# EAGLE board axion (EAGLE 8.3.1)
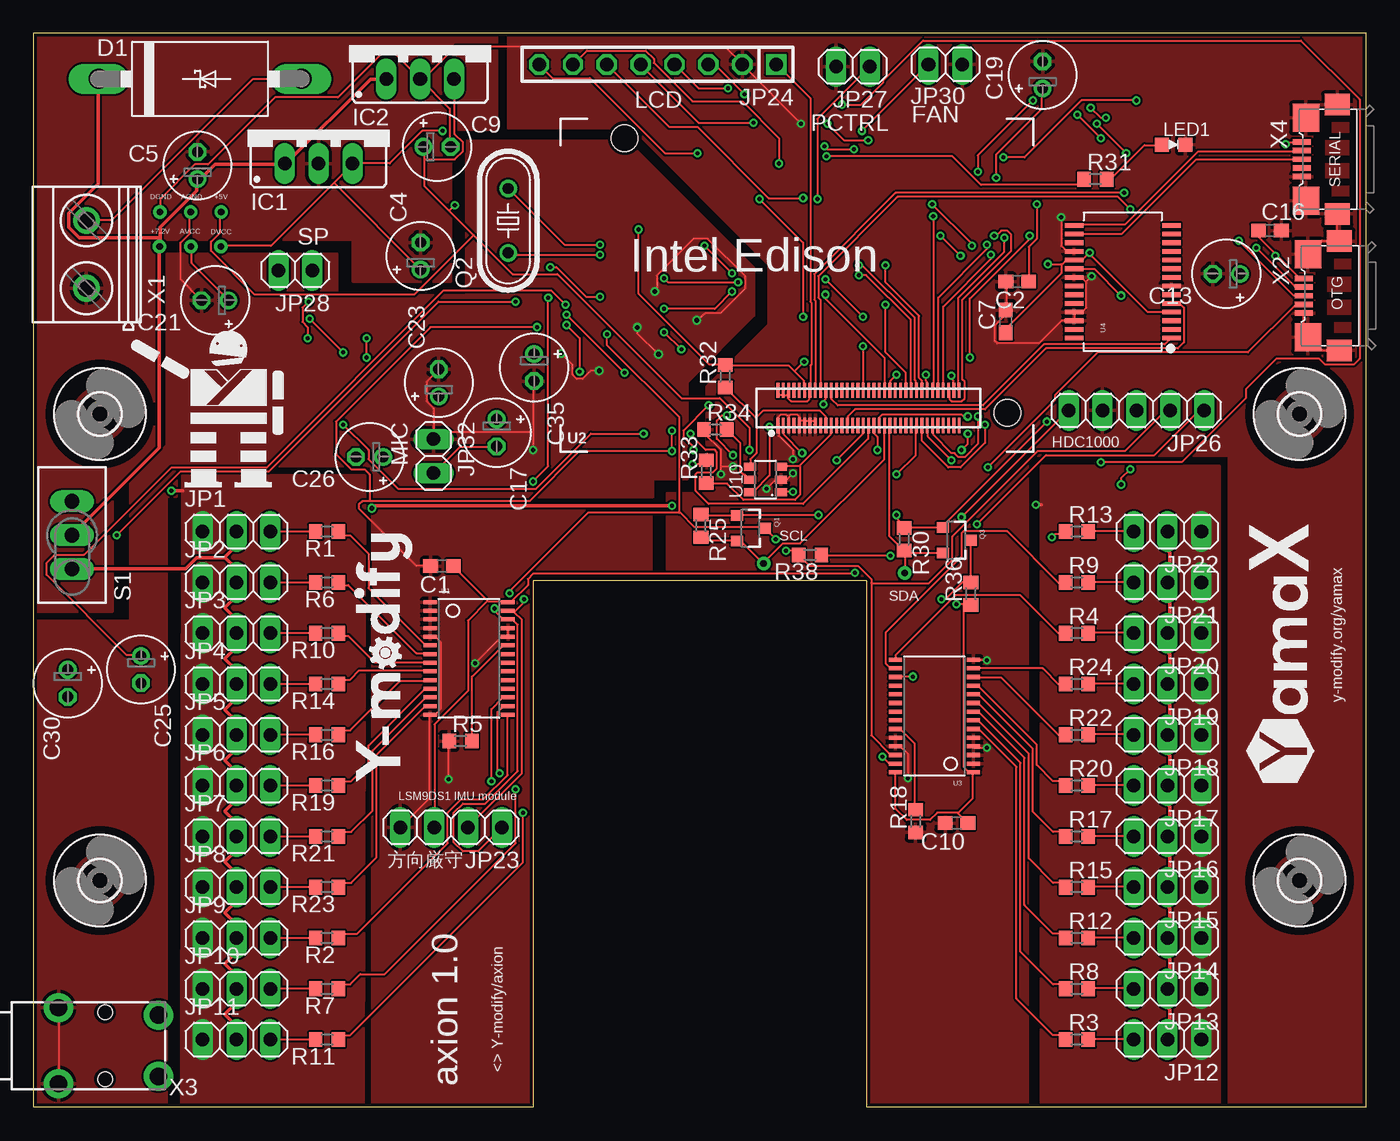
[diagram p1: board, top side]
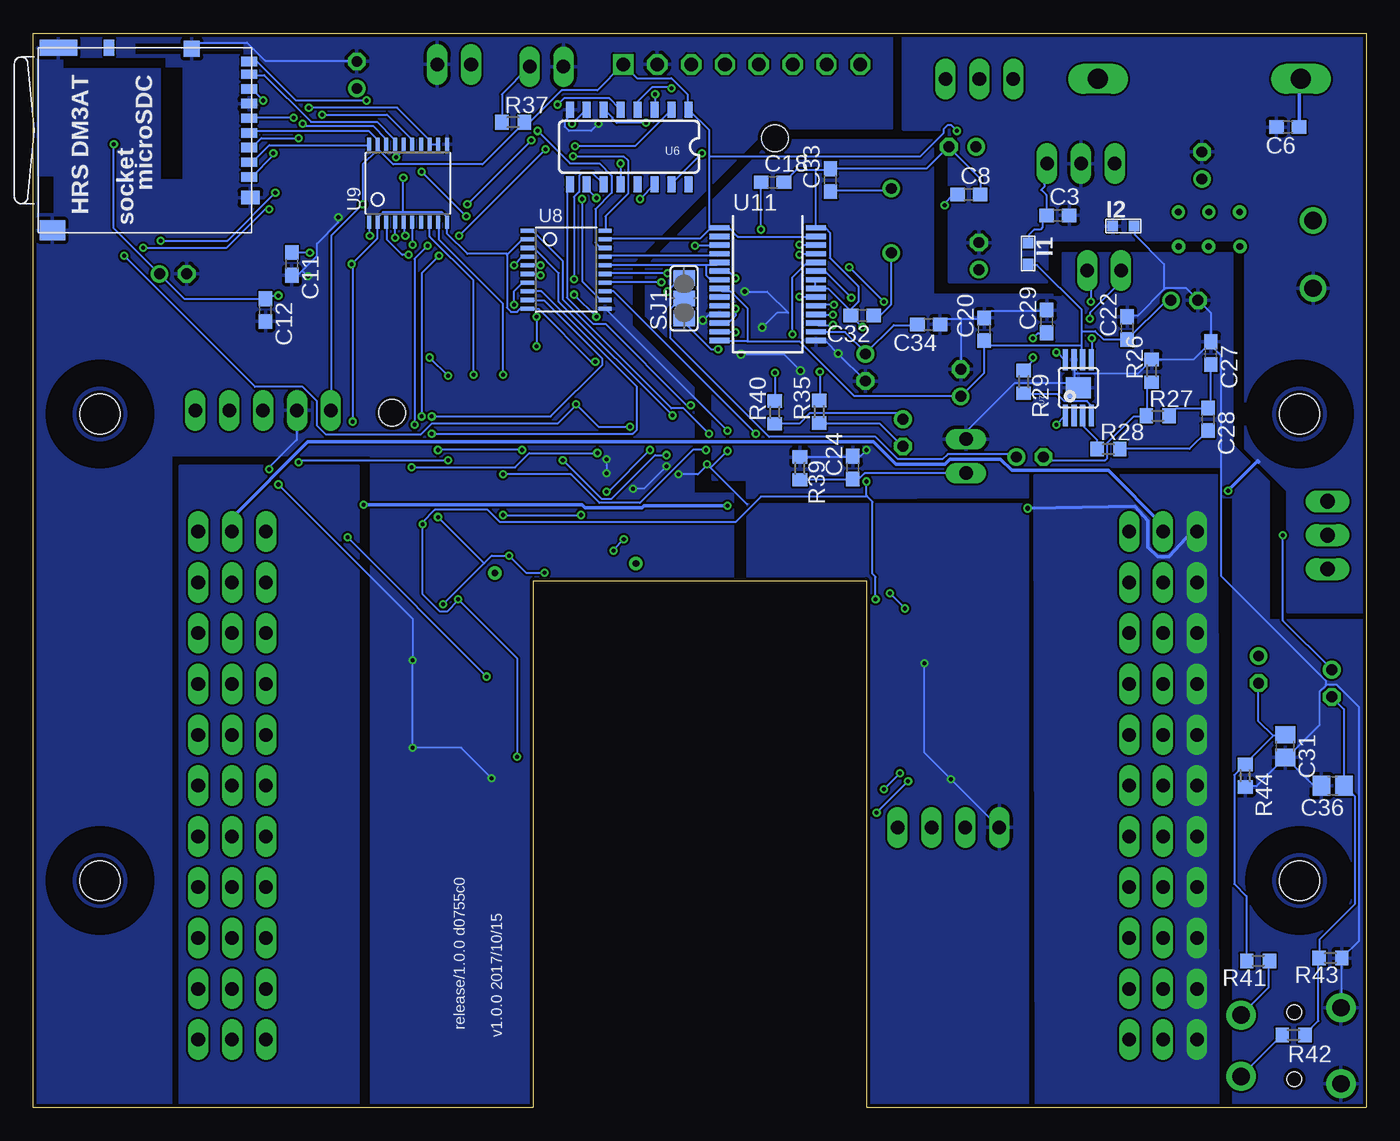
[diagram p2: board, bottom side, seen from below]

Size 100 x 80.55 mm. Coordinates in mm from the lower left corner, seen from the top.
Outline: 100,0 100,80.55 0,80.55 0,0 37.5,0 37.5,39.5 62.5,39.5 62.5,0 100,0
Copper layers (1*16): Top 0.035mm / dielectric 1.5mm / Bottom 0.035mm
Design rules "SeeedStudio_2layer_DRU_no_angle_20140221": minimum track width 6mil, minimum drill 12mil, track to track 6mil, track to pad 6mil, pad to pad 6mil, via to via 6mil, smd to smd 0mil, copper to edge 10mil, drill to drill 10mil, minimum pad ring 10mil, minimum via ring 6mil, stop-mask expansion 2mil, vias tented up to drill 100mil, thermal gap 10mil
Net classes: 1 motorpower: width 0.254 mm, drill 0.152 mm; 2 power: width 0.152 mm, drill 0.152 mm

## Footprints (pad centres in the part's own frame; a part is rotated, then mirrored left to right if it is on the bottom)
C1608 = smd 1.1 x 1: 1 -0.85,0; 2 0.85,0
E2-5 = drill 0.813 pad 1.27: + -1.016,0 | drill 0.813 pad 1.27 octagon: - 1.016,0
C0805 = smd 1.3 x 1.5: 1 -0.85,0; 2 0.85,0
DO201T15 = drill 1.499 long: A 7.62,0; C -7.62,0
3,0 = hole 3: 0,0
1608(1.6*0.8MM) = smd 0.8 x 0.8: P$3 -0.8,0; P$4 0.8,0
78XXS = drill 1.016 long: GND 0,-2.54; IN -2.54,-2.54; OUT 2.54,-2.54
1X03 = drill 1.016 long: 1 -2.54,0; 2 0,0; 3 2.54,0
1X04 = drill 1.016 long: 1 -3.81,0; 2 -1.27,0; 3 1.27,0; 4 3.81,0
1X08 = drill 1.016 square: 1 -8.89,0 | drill 1.016 octagon: 2 -6.35,0; 3 -3.81,0; 4 -1.27,0; 5 1.27,0; 6 3.81,0; 7 6.35,0; 8 8.89,0
DM3AT-SF-PEJ = smd 0.7 x 1.2: 1 0,0.6; 2 -1.1,0.6; 3 -2.2,0.6; 4 -3.3,0.6; 5 -4.4,0.6; 6 -5.5,0.6; 7 -6.6,0.6; 8 -7.7,0.6; CC1 -8.65,0.6 | smd 1.2 x 2.8: CASE1 -9.7,-13.7 | smd 1.5 x 1.9: CASE2 4,-14.15 | smd 1 x 1.4: CASE3 1.55,0.7 | smd 1.2 x 1.2: CASE4 -9.6,-3.7 | smd 1.2 x 0.8: CC2 -9.7,-9.9
1X05 = drill 1.016 long: 1 -5.08,0; 2 -2.54,0; 3 0,0; 4 2.54,0; 5 5.08,0
1X02 = drill 1.016 long: 1 -1.27,0; 2 1.27,0
LED1608 = smd 1.05 x 1.08: A -0.875,0; K 0.875,0
SOT23-3 = smd 0.8 x 0.9: 1 -0.95,-1; 2 0.95,-1; 3 0,1.1
HC49/S = drill 0.813: 1 -2.413,0; 2 2.413,0
R0603 = smd 1 x 1.1: 1 -0.85,0; 2 0.85,0
TL3XPO = drill 1.1 pad 1.422 long: 1 -2.54,0; 2 0,0; 3 2.54,0
SJ_2 = smd 1.168 x 1.6: 1 -1.524,0; 2 0,0; 3 1.524,0
ROUND-AUTO-0.5 = drill 0.5: TP 0,0
TSSOP28 = smd 0.305 x 0.991: 1 -4.225,-2.918; 2 -3.575,-2.918; 3 -2.925,-2.918; 4 -2.275,-2.918; 5 -1.625,-2.918; 6 -0.975,-2.918; 7 -0.325,-2.918; 8 0.325,-2.918; 9 0.975,-2.918; 10 1.625,-2.918; 11 2.275,-2.918; 12 2.925,-2.918; 13 3.575,-2.918; 14 4.225,-2.918; 15 4.225,2.918; 16 3.575,2.918; 17 2.925,2.918; 18 2.275,2.918; 19 1.625,2.918; 20 0.975,2.918; 21 0.325,2.918; 22 -0.325,2.918; 23 -0.975,2.918; 24 -1.625,2.918; 25 -2.275,2.918; 26 -2.925,2.918; 27 -3.575,2.918; 28 -4.225,2.918
EDISON_DAUGHTER = smd 1.14 x 0.2: 1 1.98,19.17; 2 4.62,19.17; 3 1.98,18.77; 4 4.62,18.77; 5 1.98,18.37; 6 4.62,18.37; 7 1.98,17.97; 8 4.62,17.97; 9 1.98,17.57; 10 4.62,17.57; 11 1.98,17.17; 12 4.62,17.17; 13 1.98,16.77; 14 4.62,16.77; 15 1.98,16.37; 16 4.62,16.37; 17 1.98,15.97; 18 4.62,15.97; 19 1.98,15.57; 20 4.62,15.57; 21 1.98,15.17; 22 4.62,15.17; 23 1.98,14.77; 24 4.62,14.77; 25 1.98,14.37; 26 4.62,14.37; 27 1.98,13.97; 28 4.62,13.97; 29 1.98,13.57; 30 4.62,13.57; 31 1.98,13.17; 32 4.62,13.17; 33 1.98,12.77; 34 4.62,12.77; 35 1.98,12.37; 36 4.62,12.37; 37 1.98,11.97; 38 4.62,11.97; 39 1.98,11.57; 40 4.62,11.57; 41 1.98,11.17; 42 4.62,11.17; 43 1.98,10.77; 44 4.62,10.77; 45 1.98,10.37; 46 4.62,10.37; 47 1.98,9.97; 48 4.62,9.97; 49 1.98,9.57; 50 4.62,9.57; 51 1.98,9.17; 52 4.62,9.17; 53 1.98,8.77; 54 4.62,8.77; 55 1.98,8.37; 56 4.62,8.37; 57 1.98,7.97; 58 4.62,7.97; 59 1.98,7.57; 60 4.62,7.57; 61 1.98,7.17; 62 4.62,7.17; 63 1.98,6.77; 64 4.62,6.77; 65 1.98,6.37; 66 4.62,6.37; 67 1.98,5.97; 68 4.62,5.97; 69 1.98,5.57; 70 4.62,5.57 | hole 2: 23.53,30.67; 2.93,1.98
SSOP28DB = smd 0.348 x 1.397: 1 -4.225,-3.656; 2 -3.575,-3.656; 3 -2.925,-3.656; 4 -2.275,-3.656; 5 -1.625,-3.656; 6 -0.975,-3.656; 7 -0.325,-3.656; 8 0.325,-3.656; 9 0.975,-3.656; 10 1.625,-3.656; 11 2.275,-3.656; 12 2.925,-3.656; 13 3.575,-3.656; 14 4.225,-3.656; 15 4.225,3.656; 16 3.575,3.656; 17 2.925,3.656; 18 2.275,3.656; 19 1.625,3.656; 20 0.975,3.656; 21 0.325,3.656; 22 -0.325,3.656; 23 -0.975,3.656; 24 -1.625,3.656; 25 -2.275,3.656; 26 -2.925,3.656; 27 -3.575,3.656; 28 -4.225,3.656
SO016 = smd 0.6 x 1.2: 1 -4.445,-2.8; 2 -3.175,-2.8; 3 -1.905,-2.8; 4 -0.635,-2.8; 5 0.635,-2.8; 6 1.905,-2.8; 7 3.175,-2.8; 8 4.445,-2.8; 9 4.445,2.8; 10 3.175,2.8; 11 1.905,2.8; 12 0.635,2.8; 13 -0.635,2.8; 14 -1.905,2.8; 15 -3.175,2.8; 16 -4.445,2.8
POWER-SOP8 = smd 0.4 x 1.6: 1 -0.975,-2.1; 2 -0.325,-2.1; 3 0.325,-2.1; 4 0.975,-2.1; 5 0.975,2.1; 6 0.325,2.1; 7 -0.325,2.1; 8 -0.975,2.1 | smd 1.89 x 1.57: 9 0,0
TSSOP20 = smd 0.305 x 0.991: 1 -2.925,-2.918; 2 -2.275,-2.918; 3 -1.625,-2.918; 4 -0.975,-2.918; 5 -0.325,-2.918; 6 0.325,-2.918; 7 0.975,-2.918; 8 1.625,-2.918; 9 2.275,-2.918; 10 2.925,-2.918; 11 2.925,2.918; 12 2.275,2.918; 13 1.625,2.918; 14 0.975,2.918; 15 0.325,2.918; 16 -0.325,2.918; 17 -0.975,2.918; 18 -1.625,2.918; 19 -2.275,2.918; 20 -2.925,2.918
SOT23-6 = smd 0.6 x 0.9: 1 -0.95,-1.15; 2 0,-1.15; 3 0.95,-1.15; 4 0.95,1.15; 5 0,1.15; 6 -0.95,1.15
SSOP28 = smd 0.4 x 1.5: 1 -4.225,-3.625; 2 -3.575,-3.625; 3 -2.925,-3.625; 4 -2.275,-3.625; 5 -1.625,-3.625; 6 -0.975,-3.625; 7 -0.325,-3.625; 8 0.325,-3.625; 9 0.975,-3.625; 10 1.625,-3.625; 11 2.275,-3.625; 12 2.925,-3.625; 13 3.575,-3.625; 14 4.225,-3.625; 15 4.225,3.625; 16 3.575,3.625; 17 2.925,3.625; 18 2.275,3.625; 19 1.625,3.625; 20 0.975,3.625; 21 0.325,3.625; 22 -0.325,3.625; 23 -0.975,3.625; 24 -1.625,3.625; 25 -2.275,3.625; 26 -2.925,3.625; 27 -3.575,3.625; 28 -4.225,3.625
MKDSN1,5/2-5,08 = drill 1.3 pad 2: 1 -2.561,0.025; 2 2.519,0.025
ZX62R-AB-5P = smd 1.35 x 0.4: 1 2.675,-1.3; 2 2.675,-0.65; 3 2.675,0; 4 2.675,0.65; 5 2.675,1.3 | smd 1.9 x 1.6: S1 0,-4.1; S2 0,4.1 | smd 2 x 2.1: S3 2.35,3.1; S4 2.35,-3.1
ST-005-G = drill 1.3 pad 2.184: 1 -2.85,-6.1; 2 -2.3,-13.6; 3 2.3,-13.6; 4 2.85,-6.1 | hole 1.1: -2.5,-9.6; 2.5,-9.6
ZX62R-B-5P = smd 1.35 x 0.4: 1 2.675,-1.3; 2 2.675,-0.65; 3 2.675,0; 4 2.675,0.65; 5 2.675,1.3 | smd 1.9 x 1.6: S1 0,-4.1; S2 0,4.1 | smd 2 x 2.1: S3 2.35,3.1; S4 2.35,-3.1

## Placement (x,y rotation side)
C1  0.1u  [C1608]  30.65,40.6 180 top
C2  0.1u  [C1608]  73.81,61.93 180 top
C3  0.1u  [C1608]  23.13,66.89 0 bottom
C4  33u  [E2-5]  29.06,63.84 90 top
C5  33u  [E2-5]  12.32,70.64 90 top
C6  0.1u  [C1608]  5.88,73.52 180 bottom
C7  0.1u  [C1608]  72.96,58.95 90 top
C8  0.1u  [C1608]  29.81,68.45 0 bottom
C9  33u  [E2-5]  30.29,72.05 0 top
C10  0.1u  [C1608]  69.26,21.32 180 top
C11  0.1u  [C1608]  80.6,63.25 270 bottom
C12  0.1u  [C1608]  82.58,59.8 270 bottom
C13  10u  [E2-5]  89.51,62.51 180 top
C16  0.1u  [C1608]  92.78,65.76 0 top
C17  1u  [E2-5]  34.76,50.59 270 top
C18  0.1u  [C1608]  44.53,69.38 0 bottom
C19  10u  [E2-5]  75.73,77.43 90 top
C20  0.1u  [C1608]  28.65,58.36 90 bottom
C21  10u  [E2-5]  13.63,60.53 180 top
C22  0.1u  [C1608]  17.93,58.45 90 bottom
C23  10u  [E2-5]  30.42,54.34 90 top
C24  220p  [C1608]  38.52,47.98 90 bottom
C25  1u  [E2-5]  8.08,32.83 270 top
C26  10u  [E2-5]  25.23,48.78 180 top
C27  0.022u  [C1608]  11.66,56.57 270 bottom
C28  0.01u  [C1608]  11.87,51.6 270 bottom
C29  0.01u  [C1608]  23.96,58.94 90 bottom
C30  1u  [E2-5]  2.58,31.8 270 top
C31  220p  [C0805]  6.08,27.09 270 bottom
C32  22p  [C1608]  37.81,59.4 180 bottom
C33  22p  [C1608]  40.2,69.54 90 bottom
C34  0.1u  [C1608]  32.82,58.72 180 bottom
C35  10u  [E2-5]  37.57,55.49 270 top
C36  220p  [C0805]  2.51,24.12 180 bottom
D1  45V10A  [DO201T15]  12.51,77.13 0 top
H1  MOUNT-HOLE3.0  [3,0]  5,52 0 top
H2  MOUNT-HOLE3.0  [3,0]  5,17 0 top
H3  MOUNT-HOLE3.0  [3,0]  95,17 0 top
H4  MOUNT-HOLE3.0  [3,0]  95,52 0 top
I1  [1608(1.6*0.8MM)]  25.36,64.03 270 bottom
I2  [1608(1.6*0.8MM)]  18.22,66.1 0 bottom
IC1  3.3V  [78XXS]  21.4,73.32 0 top
IC2  5V  [78XXS]  29.02,79.67 0 top
JP1  [1X03]  15.24,43.18 0 top
JP2  [1X03]  15.24,39.37 0 top
JP3  [1X03]  15.24,35.56 0 top
JP4  [1X03]  15.24,31.75 0 top
JP5  [1X03]  15.24,27.94 0 top
JP6  [1X03]  15.24,24.13 0 top
JP7  [1X03]  15.24,20.32 0 top
JP8  [1X03]  15.24,16.51 0 top
JP9  [1X03]  15.24,12.7 0 top
JP10  [1X03]  15.24,8.89 0 top
JP11  [1X03]  15.24,5.08 0 top
JP12  [1X03]  85.09,5.08 180 top
JP13  [1X03]  85.09,8.89 180 top
JP14  [1X03]  85.09,12.7 180 top
JP15  [1X03]  85.09,16.51 180 top
JP16  [1X03]  85.09,20.32 180 top
JP17  [1X03]  85.09,24.13 180 top
JP18  [1X03]  85.09,27.94 180 top
JP19  [1X03]  85.09,31.75 180 top
JP20  [1X03]  85.09,35.56 180 top
JP21  [1X03]  85.09,39.37 180 top
JP22  [1X03]  85.09,43.18 180 top
JP23  LSM9DS1 IMU module  [1X04]  31.34,21 180 top
JP24  LCD  [1X08]  46.84,78.22 180 top
JP25  DM3AT-ST-PEJ  [DM3AT-SF-PEJ]  84.42,69.78 270 bottom
JP26  HDC1000  [1X05]  82.76,52.27 180 top
JP27  PCTRL  [1X02]  61.5,78.05 180 top
JP28  SP  [1X02]  19.66,62.76 180 top
JP30  FAN  [1X02]  68.42,78.22 0 top
JP32  MIC  [1X02]  30.03,48.84 270 top
LED1  LED1608  [LED1608]  85.56,72.2 0 top
Q1  200mA/50V  [SOT23-3]  53.8,43.43 270 top
Q2  12.288Mhz  [HC49/S]  35.62,66.5 90 top
Q3  200mA/50V  [SOT23-3]  69.23,42.53 270 top
R1  220  [R0603]  22.03,43.18 180 top
R2  220  [R0603]  22.03,12.7 180 top
R3  220  [R0603]  78.3,5.08 0 top
R4  220  [R0603]  78.3,35.56 0 top
R5  10k  [R0603]  32.06,27.47 0 top
R6  220  [R0603]  22.03,39.37 180 top
R7  220  [R0603]  22.03,8.89 180 top
R8  220  [R0603]  78.3,8.89 0 top
R9  220  [R0603]  78.3,39.37 0 top
R10  220  [R0603]  22.03,35.56 180 top
R11  220  [R0603]  22.03,5.08 180 top
R12  220  [R0603]  78.3,12.7 0 top
R13  220  [R0603]  78.3,43.18 0 top
R14  220  [R0603]  22.03,31.75 180 top
R15  220  [R0603]  78.3,16.51 0 top
R16  220  [R0603]  22.03,27.94 180 top
R17  220  [R0603]  78.3,20.32 0 top
R18  10k  [R0603]  66.2,21.46 90 top
R19  220  [R0603]  22.03,24.13 180 top
R20  220  [R0603]  78.3,24.13 0 top
R21  220  [R0603]  22.03,20.32 180 top
R22  220  [R0603]  78.3,27.94 0 top
R23  220  [R0603]  22.03,16.51 180 top
R24  220  [R0603]  78.3,31.75 0 top
R25  4.7k  [R0603]  50.09,43.6 270 top
R26  47k  [R0603]  16.09,55.23 90 bottom
R27  2.2k  [R0603]  15.65,51.86 0 bottom
R28  100k  [R0603]  19.33,49.37 0 bottom
R29  100k  [R0603]  25.69,54.41 270 bottom
R30  4.7k  [R0603]  65.33,42.6 270 top
R31  220  [R0603]  79.69,69.61 0 top
R32  10k  [R0603]  51.91,54.83 90 top
R33  100k  [R0603]  50.49,47.68 90 top
R34  576  [R0603]  51.17,50.83 0 top
R35  680  [R0603]  41.05,52.17 90 bottom
R36  4.7k  [R0603]  70.34,38.52 90 top
R37  10k  [R0603]  64.01,73.89 0 bottom
R38  4.7k  [R0603]  58.27,41.43 180 top
R39  47k  [R0603]  42.48,47.92 270 bottom
R40  330  [R0603]  44.37,52.12 90 bottom
R41  5.6k  [R0603]  8.11,10.98 180 bottom
R42  5.6k  [R0603]  5.45,5.43 0 bottom
R43  5.6k  [R0603]  2.68,11.2 180 bottom
R44  5.6k  [R0603]  9.07,24.87 90 bottom
S1  TL32PO  [TL3XPO]  2.91,42.91 90 top
SJ1  [SJ_2]  51.17,60.67 90 bottom
TP1  TESTPAD-R-AUTO-0.5  [ROUND-AUTO-0.5]  9.5,67.14 0 top
TP2  TESTPAD-R-AUTO-0.5  [ROUND-AUTO-0.5]  11.81,67.14 0 top
TP3  TESTPAD-R-AUTO-0.5  [ROUND-AUTO-0.5]  14.09,67.14 0 top
TP4  TESTPAD-R-AUTO-0.5  [ROUND-AUTO-0.5]  9.48,64.56 0 top
TP5  TESTPAD-R-AUTO-0.5  [ROUND-AUTO-0.5]  11.83,64.56 0 top
TP6  TESTPAD-R-AUTO-0.5  [ROUND-AUTO-0.5]  14.08,64.56 0 top
TP7  TESTPAD-R-AUTO-0.5  [ROUND-AUTO-0.5]  65.37,40.08 0 top
TP8  TESTPAD-R-AUTO-0.5  [ROUND-AUTO-0.5]  54.78,40.79 0 top
U1  [TSSOP28]  32.69,33.67 270 top
U2  Intel Edison  [EDISON_DAUGHTER]  75.04,49.16 90 top
U3  [TSSOP28]  67.61,29.35 90 top
U4  FT232RLSSOP  [SSOP28DB]  81.74,61.92 90 top
U6  74HC4050  [SO016]  55.3,72.03 180 bottom
U7  TPA2005D1DGN  [POWER-SOP8]  21.59,53.98 0 bottom
U8  [TSSOP20]  60.02,62.83 270 bottom
U9  [TSSOP20]  71.89,69.3 0 bottom
U10  MIC2039  [SOT23-6]  54.93,47.08 90 top
U11  WM8731  [SSOP28]  44.91,61.75 270 bottom
U$1  Y-MODIFY  [Y-MODIFY]  28.41,24.46 90 top
U$2  YAMAX  [YAMAX]  96.22,24.37 90 top
U$4  MON  [MON]  11.17,46.49 0 top
X1  [MKDSN1,5/2-5,08]  4.01,63.99 90 top
X2  ZX62R-AB-5P  [ZX62R-AB-5P]  97.99,60.87 180 top
X3  ST-005-G  [ST-005-G]  -4.21,4.62 90 top
X4  ZX62R-B-5P  [ZX62R-B-5P]  97.83,71.11 180 top

## Tracks (layer width: path | path; a pad name or v marks a point on that pad's centre or on a via)
1A  (via drill 0.3)
  Top 0.152: v53.34,75.97 51.13,78.18 50.67,78.18 JP24.3
  Bottom 0.152: v53.34,75.97 53.34,74.91 U6.3
1P0
  Top 0.152: U1.6 29.72,34.67 29.41,34.67 25.15,38.94 25.15,41.53 23.77,42.9 23.16,42.9 22.94,43.13 R1.1
1P1
  Top 0.152: U1.7 29.72,34.06 28.73,34.06 23.62,39.17 23.09,39.17 22.94,39.32 R6.1
1P2
  Top 0.152: U1.8 29.72,33.38 25.6,33.38 23.62,35.36 23.09,35.36 22.94,35.51 R10.1
1P3
  Top 0.152: U1.9 29.72,32.77 24.46,32.77 23.77,32.08 23.24,32.08 22.94,31.77 R14.1
1P4
  Top 0.152: U1.10 29.72,32 27.51,32 23.77,28.27 23.24,28.27 22.94,27.96 R16.1
1P5
  Top 0.152: U1.11 29.72,31.32 29.34,31.32 25.15,27.13 25.15,25.76 23.85,24.46 23.24,24.46 22.94,24.16 R19.1
1P6
  Top 0.152: U1.12 29.72,30.71 29.41,30.71 25.45,26.75 25.45,22.25 23.85,20.65 23.24,20.65 22.94,20.34 R21.1
1P7
  Top 0.152: U1.13 29.72,30.02 29.34,30.02 25.76,26.44 25.76,18.75 23.85,16.84 23.24,16.84 22.94,16.54 R23.1
1P8
  Top 0.152: U1.15 35.59,29.41 35.59,24.92 33.76,23.09 32.08,23.09 31.09,22.1 31.09,19.81 24.31,13.03 23.24,13.03 22.94,12.72 R2.1
1P9  (via drill 0.3)
  Top 0.152: v34.98,25.07 34.82,25.22 34.82,29.64 35.2,30.02 35.59,30.02 U1.16 | v36.2,23.85 36.2,19.81 26.36,9.98 24.54,9.98 23.77,9.22 23.24,9.22 22.94,8.91 R7.1
  Bottom 0.152: v36.2,23.85 v34.98,25.07
1P10  (via drill 0.3)
  Top 0.152: v34.37,24.46 34.37,29.87 35.2,30.71 35.59,30.71 U1.17 | v36.73,22.1 36.73,18.36 23.77,5.41 23.24,5.41 22.94,5.11 R11.1
  Bottom 0.152: v36.73,22.1 v34.37,24.46
1V8I2S_BCK  (via drill 0.3)
  Top 0.152: v61.95,62.41 62.48,62.41 65.84,59.05 65.84,53.8 U2.52
  Bottom 0.152: v61.95,62.41 62.03,62.48 62.87,62.48 U8.6
1V8I2S_LRCK  (via drill 0.3)
  Top 0.152: v61.95,63.17 62.18,63.17 66.14,59.21 66.14,54.56 66.22,54.48 66.22,53.8 U2.54
  Bottom 0.152: v61.95,63.17 62.87,63.17 U8.5
1V8I2S_RXD  (via drill 0.3)
  Top 0.152: v63.93,60.2 63.93,56.62 65.46,55.09 65.46,53.8 U2.50
  Bottom 0.152: v63.93,60.2 63.93,61.19 63.32,61.8 62.94,61.8 U8.7
1V8I2S_TXD  (via drill 0.3)
  Top 0.152: v63.93,63.17 63.93,61.87 66.45,59.36 66.45,54.71 66.67,54.48 66.67,53.8 U2.56
  Bottom 0.152: v63.93,63.17 63.32,63.78 62.94,63.78 U8.4
1V8PWMFAN  (via drill 0.3)
  Top 0.152: v52.05,51.89 51.66,51.89 51.28,51.51 51.28,50.14 v52.5,48.92 | v60.27,48.54 62.26,50.52 62.26,51.13 U2.33
  Bottom 0.152: v52.05,51.89 60.58,60.43 60.58,62.56 62.41,64.39 62.87,64.39 U8.3 | v52.5,48.92 53.34,48.92 56.62,45.64 57.38,45.64 v60.27,48.54
1V8PWMLED  (via drill 0.3)
  Top 0.152: v49.3,50.52 49.53,50.29 49.53,50.22 50.44,49.3 51.13,49.3 51.28,49.15 51.28,47.93 50.98,47.62 49.84,47.62 49.68,47.47 49.68,46.25 50.67,45.26 57.76,45.26 62.64,50.14 62.64,51.13 U2.35
  Bottom 0.152: v49.3,50.52 51.21,52.43 52.12,52.43 60.27,60.58 60.27,63.48 62.48,65.68 62.87,65.68 U8.1
1V8PWRCTRL  (via drill 0.3)
  Top 0.152: v70.1,51.82 69.8,51.82 69.65,51.97 63.7,51.97 63.48,51.74 63.48,51.21 U2.39
  Bottom 0.152: v70.1,51.82 61.19,51.82 57.3,55.7 57.3,56.16 61.65,60.5 62.87,60.5 U8.9
1V8SCL
  Top 0.152: R25.2 50.14,42.75 50.37,42.52 52.73,42.52 Q1.2 52.81,42.44 53.11,42.44 54.71,40.84 TP8.TP 54.79,40.84 56.24,42.29 57.53,42.29 63.86,48.62 63.86,51.13 U2.41
1V8SDA
  Top 0.152: Q3.2 68.2,41.6 65.46,41.6 65.38,41.68 R30.2 | U2.43 64.24,51.13 64.24,42.82 65.3,41.76 R30.2 | TP7.TP 65.38,40.16 65.38,41.6 R30.2
1V8SHUTDOWN  (via drill 0.3)
  Top 0.152: v70.1,50.52 70.1,49.76 v69.65,49.3 | v63.32,49.3 63.32,50.29 63.09,50.52 63.09,51.13 U2.37
  Bottom 0.152: v70.1,50.52 55.02,50.52 54.71,50.83 54.71,54.03 61.87,61.19 62.87,61.19 U8.8 | v63.32,49.3 v69.65,49.3
1Y  (via drill 0.3)
  Top 0.152: v70.87,51.82 70.87,49.76 69.88,48.77 69.42,48.77 69.11,49.07 68.89,49.07 67.51,50.44 67.51,51.13 U2.59 | v68.05,65.38 v69.57,63.86 | v61.57,71.86 59.59,71.86 v59.36,72.08
  Bottom 0.152: v70.87,51.82 70.87,62.56 v69.57,63.86 | v61.57,71.86 v68.05,65.38 | v59.36,72.08 54.86,72.08 U6.2
2P0
  Top 0.152: U3.6 70.56,28.35 70.94,28.35 73.76,25.53 73.76,8.15 76.5,5.41 77.11,5.41 77.42,5.11 R3.1
2P1
  Top 0.152: U3.7 70.56,28.96 70.94,28.96 74.07,25.83 74.07,11.66 76.5,9.22 77.11,9.22 77.42,8.91 R8.1
2P2
  Top 0.152: U3.8 70.56,29.64 70.94,29.64 74.37,26.21 74.37,15.16 76.5,13.03 77.11,13.03 77.42,12.72 R12.1
2P3
  Top 0.152: U3.9 70.56,30.25 70.94,30.25 74.68,26.52 74.68,18.67 76.5,16.84 77.11,16.84 77.42,16.54 R15.1
2P4
  Top 0.152: U3.10 70.56,30.94 70.94,30.94 74.98,26.9 74.98,22.17 76.5,20.65 77.11,20.65 77.42,20.34 R17.1
2P5
  Top 0.152: U3.11 70.56,31.62 70.87,31.62 75.29,27.2 75.29,25.68 76.5,24.46 77.11,24.46 77.42,24.16 R20.1
2P6
  Top 0.152: U3.12 70.56,32.23 72.62,32.23 76.96,27.89 77.42,27.89 R22.1
2P7
  Top 0.152: U3.13 70.56,32.92 75.74,32.92 76.96,31.7 77.42,31.7 R24.1
2P8
  Top 0.152: U3.15 64.69,33.6 64.69,33.91 69.19,38.41 74.07,38.41 76.96,35.51 77.42,35.51 R4.1
2P9
  Top 0.152: U3.16 64.62,32.99 64.24,32.99 63.93,33.3 63.93,35.59 69.65,41.3 69.65,43.05 69.8,43.2 73.08,43.2 76.96,39.32 77.42,39.32 R9.1
2P10  (via drill 0.3)
  Top 0.152: v65.99,32.31 64.69,32.31 U3.17 | v76.43,42.75 76.66,42.98 77.27,42.98 77.42,43.13 R13.1
  Bottom 0.152: v76.43,42.75 v65.99,32.31
3V3SCL  (via drill 0.3)
  Top 0.152: JP23.1 35.13,20.95 33.38,19.2 32.23,19.2 31.55,19.89 31.55,22.1 32.23,22.78 33.91,22.78 36.35,25.22 36.35,36.2 35.97,36.58 35.66,36.58 U1.26 35.59,36.65 35.2,36.65 34.59,37.26 v34.59,37.41 | v55.7,42.6 54.94,43.36 Q1.3 54.86,43.43 54.79,43.51 49.61,43.51 48.5,44.62 | v56.46,41.76 57.07,41.76 57.38,41.45 R38.2 57.45,41.38 58.22,40.62 61.87,40.62 62.87,39.62 62.87,39.32 | 62.87,39.32 62.87,27.89 64.31,26.44 64.62,26.44 U3.26 | v43.05,57.99 43.05,57.15 48.46,51.74 48.46,44.65 48.5,44.62 | 62.87,39.32 67.21,39.32 68.96,41.07 68.96,42.82 75.36,49.23 81.92,49.23 84.89,52.2 85.27,52.2 JP26.2 | v35.74,38.56 35.74,38.71 41.6,44.58 48.46,44.58 48.5,44.62
  Bottom 0.152: v55.7,42.6 56.46,41.83 v56.46,41.76 | v43.05,57.99 43.05,62.26 41.99,63.32 41.3,63.32 U11.24 | v35.74,38.56 v34.59,37.41
3V3SDA  (via drill 0.3)
  Top 0.152: Q3.3 70.33,39.4 R36.2 70.26,39.4 69.72,39.4 68.43,38.1 v68.12,38.1 | v63.7,26.29 64.16,25.83 64.62,25.83 U3.27 | v70.79,43.74 75.97,48.92 84.12,48.92 87.4,52.2 87.78,52.2 JP26.1 | 36.08,37.15 36.65,36.58 36.65,25.07 32.61,21.03 JP23.2 | 36.08,37.15 36.04,37.19 35.66,37.19 U1.27 | v38.63,60.73 38.63,48.08 v37.49,46.94 | v36.8,38.1 36.8,37.87 36.08,37.15
  Bottom 0.152: v63.7,26.29 63.7,33.68 v68.12,38.1 68.12,38.02 68.96,37.19 69.49,37.19 70.79,38.48 v70.79,43.74 70.79,43.89 69.88,44.81 65.91,44.81 65,43.89 47.32,43.89 45.41,45.8 37.49,45.8 37.45,45.83 | v38.63,60.73 40.62,62.71 41.22,62.71 U11.23 | v37.49,46.94 37.49,45.87 37.45,45.83 | 37.45,45.83 37.03,45.41 37.03,40.01 36.8,39.78 v36.8,38.1
+1V8  (via drill 0.3)
  Top 0.152: 57.11,55.21 57.84,54.48 57.84,53.8 U2.12 | 57.11,55.21 56.69,55.63 51.97,55.63 R32.2 51.89,55.7 50.75,55.7 45.41,61.04 v45.41,65.84 | R25.1 50.14,44.42 52.73,44.42 Q1.1 52.81,44.42 v58.9,44.42 | v64.77,44.42 64.77,44.2 65.38,43.59 R30.1 65.38,43.51 68.2,43.51 Q3.1 68.2,43.59 v76.05,51.44 | 77.15,63.21 77.42,63.48 78.03,63.48 U4.19 78.11,63.55 78.72,63.55 v79.25,64.08 79.25,64.01 83.59,59.66 85.34,59.66 U4.4 | 77.15,63.21 77.11,63.17 77.11,62.56 73,58.45 73,58.14 C7.1 | v72.24,69.72 72.24,71.48 75.67,74.91 75.67,76.35 C19.+ | v76.12,63.25 77.11,63.25 77.15,63.21 | v57.84,55.93 57.11,55.21
  Bottom 0.152: v45.41,65.84 45.41,69.34 C18.1 | v64.77,44.42 v58.9,44.42 | v79.25,64.08 80.54,64.08 C11.1 | 64.43,63.97 63.32,65.08 62.94,65.08 U8.2 | 64.43,63.97 64.47,63.93 64.47,59.97 64.16,59.66 63.7,59.66 63.48,59.89 U8.10 62.87,59.89 62.1,59.89 58.14,55.93 v57.84,55.93 | 64.43,63.97 64.47,64.01 67.44,64.01 68.96,65.53 68.96,66.37 U9.10 69.04,66.45 69.04,66.83 69.34,67.13 72.24,67.13 | 72.24,67.13 73.76,67.13 74.14,66.75 74.14,66.45 U9.2 74.22,66.37 74.22,65.15 v76.12,63.25 76.05,63.25 v76.05,51.44 | 72.24,67.13 v72.24,69.72
+3V3  (via drill 0.3)
  Top 0.152: 34.1,37.99 31.55,40.54 C1.1 | 34.1,37.99 34.14,37.95 35.59,37.95 U1.28 35.66,37.95 35.89,37.95 37.11,39.17 37.11,39.62 37.49,40.01 61.57,40.01 v61.65,40.08 | 34.1,37.99 32.61,36.5 32.61,31.24 30.1,28.73 30.1,21.03 JP23.3 | 69.38,22.06 70.1,21.34 C10.1 | 69.38,22.06 69.34,22.1 67.82,22.1 67.28,21.57 65.53,21.57 64.69,22.4 64.69,25.07 U3.28 | 69.38,22.06 70.48,23.16 70.48,25.07 U3.1 70.41,25.07 70.26,25.07 69.8,25.53 69.8,37.72 | v64.31,41.38 59.13,41.38 R38.1 | 69.8,37.72 70.33,37.72 R36.1 69.8,37.72 | 69.8,37.72 v69.27,37.72 | v75.29,67.74 75.29,65.15 74.68,64.54 74.68,61.95 C2.1 | 22.55,69.34 23.93,70.71 IC1.OUT 24,70.79 26.75,70.79 29.18,73.23 v30.71,73.23 | 22.55,69.34 17.83,64.62 14.1,64.62 TP6.TP | 22.55,69.34 29.03,62.87 C4.+ | U2.2 55.93,53.72 55.93,53.49 56.01,53.42 56.16,53.42 56.24,53.49 56.24,53.72 U2.4 56.24,53.42 56.54,53.42 56.62,53.49 56.62,53.72 U2.6 56.62,53.42 56.62,53.19 56.84,52.96 58.06,52.96 58.22,53.11 58.22,53.72 U2.14 58.29,53.8 58.29,55.63 58.37,55.7 58.37,60.35 58.29,60.43 58.29,75.67 55.78,78.18 JP24.1 | v69.65,44.27 77.65,52.27 JP26.5
  Bottom 0.152: v69.27,37.72 66.18,40.8 | 66.18,40.8 65.61,41.38 v64.31,41.38 63.02,40.08 v61.65,40.08 | JP25.4 83.74,73.15 83.67,73.23 74.83,73.23 74.22,72.62 74.22,72.24 U9.19 74.22,72.16 74.22,71.78 74.26,71.74 | 74.26,71.74 75.29,70.71 v75.29,67.74 77.65,65.38 77.65,52.27 JP26.5 | I1.P$3 25.3,64.85 25.3,65.46 24.92,65.84 24.46,65.84 24.31,65.99 24.31,66.52 24,66.83 C3.1 24,66.9 24,68.43 24.38,68.81 24.16,69.04 24.16,69.27 24,69.42 24,70.71 IC1.OUT | 49.26,65.88 49.23,65.91 48.54,65.91 U11.1 48.46,65.91 47.78,65.91 47.17,65.3 41.3,65.3 U11.27 | 49.26,65.88 49.99,65.15 57.07,65.15 U8.19 | 49.3,71.32 49.3,73.3 50.83,74.83 U6.1 50.9,74.91 50.9,75.97 52.12,77.19 54.71,77.19 55.7,78.18 JP24.1 55.78,78.18 57.68,76.28 60.35,76.28 62.71,73.91 63.09,73.91 R37.2 63.17,73.84 66.29,70.71 73,70.71 73.99,71.7 74.22,71.7 74.26,71.74 | 49.3,71.32 49.3,65.91 49.26,65.88 | v30.71,73.23 31.17,73.69 31.39,73.69 31.7,73.38 31.7,73.08 33.45,71.32 49.3,71.32 | v69.65,44.27 66.18,40.8
+5V  (via drill 0.3)
  Top 0.152: v57,46.18 56.08,46.18 U10.1 | v53.72,49.3 53.72,50.98 51.51,53.19 48.62,53.19 39.32,62.48 35.97,62.48 33.03,65.42 | 31.2,67.25 29.34,69.11 29.34,71.09 | 31.2,67.25 33.03,65.42 | 29.34,71.09 29.34,72.01 C9.+ | 31.2,67.25 v31.62,67.67 | 33.03,65.42 28.57,60.96 16.61,60.96 13.34,64.24 13.34,64.92 14.02,65.61 14.02,67.13 TP3.TP | 29.34,71.09 31.62,71.09 32.23,71.7 32.23,72.39 31.62,73 31.62,77.11 IC2.OUT
  Bottom 0.152: v57,46.18 56.84,46.18 v53.72,49.3 | v31.62,67.67 31.62,67.82 31.01,68.43 30.71,68.43 C8.1
AGND  (via drill 0.3, 0.35)
  Top 0.152: X3.1 1.91,1.83 1.91,7.47 X3.4 | TP2.TP 11.73,67.13 11.73,65.53 11.05,64.85 11.05,62.1 12.57,60.58 C21.- | 37.49,50.67 37.49,54.33 37.57,54.41 C35.- | 37.49,50.67 v37.49,49.3 | 30.02,50.67 30.02,52.43 29.49,52.96 29.49,54.41 30.4,55.32 C23.- | 30.02,50.67 30.02,50.14 JP32.1 30.02,50.67 | 30.02,50.67 37.49,50.67 | v49.77,59.04 50.43,59.59 51.58,59.59 53.42,61.42 53.42,62.32 50.59,65.15 49.54,65.15 46.79,62.4 46.79,61.34 v46.63,61.18 | v45.31,58.5 45.31,58.07 v46.9,56.48 | v42.45,55.24 41.82,55.24 41.22,54.63 40.77,54.63 40.46,54.95 40.46,55.69 v39.62,56.53
  Bottom 0.152: R44.1 9.07,24.08 8.23,24.08 6.1,26.21 C31.2 | C36.2 3.43,24.16 3.96,24.16 6.02,26.21 C31.2 | X3.4 1.83,7.54 1.83,11.12 R43.1 0.53,12.5 0.53,30.02 2.21,31.7 2.97,31.7 3.01,31.66 | 3.01,31.66 3.5,31.17 3.5,28.65 5.94,26.21 C31.2 | 21.87,54.33 21.87,54.25 U7.9 21.87,54.33 | 21.87,54.33 21.87,55.02 | 21.87,55.02 21.87,56.01 U7.7 | C27.1 11.66,59.59 12.57,60.5 C21.- 12.65,60.58 13.49,61.42 15.09,61.42 15.13,61.38 | C27.1 11.66,57.38 12.95,56.08 16.08,56.08 R26.2 16.15,56.01 17.14,55.02 21.87,55.02 | 15.13,61.38 17.14,59.36 17.91,59.36 C22.2 | 15.13,61.38 15.16,61.42 15.16,63.25 17.37,65.46 17.37,66.06 I2.P$4 | R39.1 42.44,48.77 38.56,48.77 C24.2 38.48,48.84 37.95,48.84 v37.49,49.3 | U11.15 41.22,57.45 40.54,57.45 v39.62,56.53 37.57,54.48 C35.- | 30.4,59.13 31.55,59.13 31.93,58.75 C34.1 | 30.4,59.13 28.65,59.13 C20.2 28.12,59.74 24,59.74 C29.2 | 30.4,59.13 30.4,55.4 C23.- | 21.87,54.33 26.36,54.33 30.02,50.67 30.02,50.14 JP32.1 | 3.01,31.66 3.05,31.7 3.05,32 10.9,39.85 10.9,56.39 11.73,57.23 C27.1 | U11.11 49.24,59.47 v49.77,59.04 | v46.63,61.18 44.95,61.18 43.36,59.59 44.22,59.59 v45.31,58.5 | v46.9,56.48 43.69,56.48 v42.45,55.24
  pour Top: 0,0 0,36.52 7.26,36.52 7.26,46.91 10.02,49.68 10.02,64.04 22.81,64.04 22.81,60.75 23.5,60.75 23.5,60.93 32.48,60.93 32.48,72.52 44.58,72.52 44.58,72.51 54.08,63 54.08,59.36 49.07,54.35 49.07,47.08 46.48,47.08 46.48,45.73 33.69,45.73 33.79,45.77 25.36,45.77 25.36,48.03 10.75,48.03 10.75,45.77 10.01,45.77 10.01,0
  pour Bottom: 0,0 0,36.52 7.26,36.52 7.26,46.91 10.02,49.68 10.02,64.04 22.81,64.04 22.81,60.75 23.5,60.75 23.5,60.93 32.48,60.93 32.48,72.52 44.58,72.52 44.58,72.51 54.08,63 54.08,59.36 49.07,54.35 49.07,47.08 46.48,47.08 46.48,45.73 33.69,45.73 33.79,45.77 25.34,45.77 25.34,48.03 10.75,48.03 10.75,45.77 10.01,45.77 10.01,0
AOUTL  (via drill 0.3)
  Top 0.152: v47.32,59.89 51.13,59.89 v52.43,61.19
  Bottom 0.152: v47.32,59.89 47.32,59.36 47.85,58.83 48.46,58.83 U11.12 | v52.43,61.19 51.44,62.18 51.21,62.18 SJ1.3
AOUTR  (via drill 0.3)
  Top 0.152: v48.62,56.84 v47.32,58.14
  Bottom 0.152: v47.32,58.14 48.46,58.14 U11.13 | v48.62,56.84 49.15,56.84 51.13,58.83 51.13,59.13 SJ1.1
AVCC
  Top 0.152: TP5.TP 11.89,64.54 11.89,63.32 14.63,60.58 C21.+
  Bottom 0.152: 21.34,57.15 21.34,56.08 U7.6 | 21.34,57.15 21.34,58.22 | 21.34,58.22 21.34,59.82 24.69,63.17 25.3,63.17 I1.P$4 | 21.34,58.22 20.34,58.22 19.74,57.61 17.98,57.61 C22.1 17.91,57.61 15.01,60.5 14.71,60.5 C21.+ | 49.23,57.53 U11.14 48.46,57.45 46.42,57.45 | 49.23,61.42 U11.8 48.31,61.2 47.69,61.2 46.42,59.94 46.42,57.45 | 28.65,57.15 28.65,55.09 30.4,53.34 C23.+ 30.48,53.34 38.41,53.34 42.52,57.45 46.42,57.45 | 28.65,57.15 C20.1 28.65,57.45 | 28.65,57.15 21.34,57.15
DGND  (via drill 0.3)
  Top 0.152: IC2.GND 27.2,78.94 26.06,78.94 22.86,75.74 18.14,75.74 13.11,70.71 12.12,70.71 9.53,68.12 9.53,67.21 TP1.TP | IC2.GND 31.24,74.91 31.24,72.08 C9.- | U2.15 58.6,51.21 58.6,51.44 58.52,51.51 58.22,51.51 U2.13 58.22,51.21 58.22,51.44 58.14,51.51 57.84,51.51 U2.11 57.84,51.21 57.84,51.44 57.76,51.51 57.61,51.51 57.53,51.44 57.53,51.21 U2.9 57.53,51.51 57.53,51.74 57.3,51.97 56.84,51.97 56.73,51.85 | 56.73,51.85 56.69,51.82 56.69,51.21 U2.5 | IC2.GND 29.18,77.04 31.7,79.55 51.89,79.55 53.19,78.26 JP24.2 53.19,78.18 v57.61,73.76 | v49.45,48.23 50.22,48.23 50.44,48.46 R33.2 | v57,47.55 56.54,47.09 56.08,47.09 U10.2 56.01,47.02 55.63,47.02 v55.02,46.41 | v57,48.62 57,49.3 55.93,50.37 55.93,51.13 U2.1 55.93,51.21 55.93,51.82 56.08,51.97 56.46,51.97 56.54,51.89 56.69,51.89 56.73,51.85 | v47.93,50.75 v47.93,49.23 41,49.23 37.26,45.49 25.22,45.49 | v51.59,47.47 51.59,48.08 | 51.59,48.08 51.59,49.3 50.37,50.52 50.37,50.83 R34.1 | 51.59,48.08 v52.5,48.08 | U1.5 29.79,35.28 30.18,35.28 30.56,34.9 30.56,29.87 30.18,29.49 29.79,29.49 U1.14 29.72,29.41 29.72,23.16 27.58,21.03 JP23.4 | U1.25 35.59,35.89 35.59,35.36 U1.24 35.51,35.36 35.2,35.36 v33.15,33.3 | v31.17,24.61 31.17,27.43 R5.1 | 25.22,45.49 24.69,45.49 24.46,45.26 24.46,44.88 28.73,40.62 29.79,40.62 C1.2 | v71.55,33.53 70.56,33.53 U3.14 | v71.55,26.98 70.64,26.98 70.56,27.05 U3.4 | v65.61,24.69 65.61,26.52 65.08,27.05 64.69,27.05 U3.25 | C2.2 73,61.87 73,59.82 C7.2 72.92,59.74 72.92,59.44 72.16,58.67 72.16,57.45 72.31,57.3 75.44,57.3 77.11,58.98 78.03,58.98 U4.26 78.11,59.05 78.11,59.59 U4.25 78.18,59.59 78.64,59.59 79.02,59.97 79.02,61.87 78.98,61.91
  Top 0.152: 78.98,61.91 78.72,62.18 78.11,62.18 U4.21 | X4.S2 97.84,66.98 97.84,65.08 97.92,65 X2.S1 97.84,65 96.7,65 95.71,64.01 X2.S4 | X2.5 95.33,59.51 95.33,58.14 95.63,57.84 X2.S3 95.71,57.76 96.7,56.77 97.92,56.77 X2.S2 | v77.11,66.75 77.11,64.62 77.5,64.24 78.03,64.24 U4.18 | v79.4,62.33 78.98,61.91 | v81.61,46.71 81.61,47.17 v82.3,47.85 | 25.22,45.49 25.22,47.47 24.84,47.85 23.85,47.85 22.71,49 22.71,51.44 29.79,58.52 v37.8,58.52
  Bottom 0.152: C32.2 38.71,59.44 38.71,59.74 40.39,61.42 41.22,61.42 U11.21 41.3,61.49 41.3,62.03 U11.22 | 41.3,70.33 42.75,70.33 43.66,69.42 C18.2 | 41.3,70.33 40.23,70.33 C33.2 40.16,70.41 32.99,70.41 31.39,72.01 C9.- 31.32,72.01 28.96,69.65 28.96,68.5 C8.2 | 41.3,70.33 41.3,65.99 U11.28 41.22,65.91 40.54,65.91 40.23,65.61 40.23,63.7 38.1,61.57 38.1,60.43 38.71,59.82 C32.2 | JP25.CASE1 98.07,79.48 98.04,79.55 | 49.19,47.97 v49.45,48.23 49.45,48.16 50.14,47.47 v51.59,47.47 | 49.19,47.97 46.48,45.26 46.43,45.25 | v57,48.62 v57,47.55 | v47.93,50.75 57.07,59.89 U8.11 | 49.19,47.97 v47.93,49.23 | v55.02,46.41 54.18,46.41 v52.5,48.08 | JP23.4 27.58,21.03 v31.17,24.61 33.15,26.59 v33.15,33.3 | v65.61,24.69 67.89,26.98 v71.55,26.98 v71.55,33.53 71.55,36.65 v81.61,46.71 | v57.61,73.76 58.14,73.23 59.82,73.23 60.12,73.53 60.12,73.99 59.82,74.3 59.82,74.83 U6.8 | v77.11,66.75 77.11,66.37 78.72,64.77 78.72,63.86 79.82,62.75 | 79.82,62.75 80.16,62.41 80.54,62.41 C11.2 | C19.- 75.74,78.49 82.6,78.49 83.97,79.86 87.63,79.86 88.09,79.4 JP25.CASE4 | 79.82,62.75 v79.4,62.33 | v82.3,47.85 82.3,48.01 80.24,50.06 80.24,52.2 JP26.4 | v37.8,58.52 38.63,59.36 C32.2
  pour Bottom: 74.66,0 74.64,48.85 89.67,48.85 89.67,0 100,0 100,80.55 35.59,80.55 35.59,73.39 44.91,73.39 55.12,63.18 55.12,58.67 50.45,54 50.45,46.04 47.52,46.04 47.52,39.5 62.5,39.5 62.5,0
  pour Bottom: 37.5,0 37.53,39.5 46.43,39.5 46.43,45.25 37.37,45.25 25.4,45.25 25.4,0
  pour Top: 74.66,0.02 74.64,48.88 89.67,48.88 89.67,0.02 100,0 100,80.55 35.59,80.55 35.59,73.41 44.91,73.41 55.12,63.2 55.12,58.69 50.45,54.03 50.45,46.07 47.52,46.07 47.52,39.52 62.5,39.52 62.5,0.02
  pour Top: 37.5,0 37.53,39.5 46.43,39.5 46.43,45.25 37.37,45.25 25.4,45.25 25.4,0
GND  (via drill 0.3, 0.35)
  Top 0.254: v10.36,46.25 11.2,46.25 11.22,46.25 | v47.93,45.11 25.41,45.12 25.4,45.11 v25.4,44.93 | 75.62,45.19 v75.21,45.19
  Bottom 0.254: v10.36,46.25 8.15,48.46 8.13,48.48 | 8.08,48.39 8.05,48.41 | v47.93,45.11 54.18,45.11 54.33,44.96 58.6,44.96 58.83,45.19 v75.21,45.19 | JP1.1 13.08,43.18 14.82,41.29 15.64,41.29 16.39,42.01 16.4,43.99 17.37,45.1 25.25,44.93 v25.4,44.93
  pour Top: 0,37.13 0,80.55 34.75,80.55 34.75,73.37 31.31,73.37 31.31,61.95 24,61.95 24,65.1 9.07,65.1 9.07,49.42 5.93,46.28 5.93,37.2 0.07,37.2
  pour Bottom: 0,80.55 34.72,80.55 34.72,73.35 31.28,73.35 31.28,61.92 23.97,61.92 23.97,65.07 9.04,65.07 9.04,49.4 5.9,46.25 5.9,37.17 0.05,37.17
  pour Bottom (no thermals): 11.13,0 11.22,47.38 24.85,47.38 24.76,0
  pour Top (no thermals): 11.13,0 11.22,47.38 24.85,47.38 24.76,0
  pour Top (no thermals): 88.99,0 88.99,48.08 75.62,48.08 75.62,-0.08 88.83,-0.08
I2S_BCK  (via drill 0.3)
  Top 0.152: v50.37,64.62 v52.43,62.56
  Bottom 0.152: v52.43,62.56 57.07,62.56 U8.15 | v50.37,64.62 48.54,64.62 U11.3
I2S_LRCK
  Bottom 0.152: 49.53,63.17 48.69,63.17 48.54,63.32 U11.5 | 49.53,63.17 57.07,63.17 U8.16 | 49.53,63.17 49.53,62.41 49.23,62.1 48.54,62.1 U11.7
I2S_RXD  (via drill 0.3)
  Top 0.152: v52.88,61.87 47.62,61.87 v47.32,62.18
  Bottom 0.152: v52.88,61.87 57.07,61.87 U8.14 | v47.32,62.18 47.85,62.71 48.46,62.71 U11.6
I2S_TXD
  Bottom 0.152: U8.17 57.07,63.86 48.69,63.86 48.54,64.01 U11.4
LCD_DC  (via drill 0.3)
  Top 0.152: v59.44,60.96 59.44,60.66 63.86,56.24 63.86,53.8 U2.42 | v57.76,59.28 57.76,64.85 v54.48,68.12
  Bottom 0.152: v57.76,59.28 v59.44,60.96 | v54.48,68.12 53.42,69.19 U6.14
LCD_RST  (via drill 0.3)
  Top 0.152: v62.26,57.07 62.26,53.8 U2.34 | v59.44,62.1 v62.26,59.28
  Bottom 0.152: v62.26,59.28 v62.26,57.07 | v59.44,62.1 59.44,68.28 59.05,68.66 59.05,69.88 58.83,70.1 58.06,70.1 57.23,69.27 U6.11
LLINEIN  (via drill 0.3)
  Top 0.152: v42.52,60.81 41.45,60.81 39.24,63.02 v38.79,63.02 | v36.2,60.43 30.4,60.43 17.68,47.7 11.05,47.7 v6.25,42.9
  Bottom 0.152: v42.52,60.81 41.3,60.81 U11.20 | v36.2,60.43 v38.79,63.02 | v6.25,42.9 6.25,36.5 2.59,32.84 C30.+
N$1
  Top 0.152: R1.2 21.18,43.2 17.83,43.2 JP1.3
N$2
  Top 0.152: X1.2 4.04,66.52 5.87,66.52 16.46,77.11 20.12,77.11 D1.A
N$3
  Top 0.152: R6.2 21.18,39.4 17.83,39.4 JP2.3
N$4
  Top 0.152: U1.23 35.59,34.59 35.2,34.59 32.92,32.31 32.92,27.51 R5.2
N$5
  Top 0.152: R10.2 21.18,35.59 17.83,35.59 JP3.3
N$6
  Top 0.152: U3.23 64.69,28.35 65.08,28.35 66.14,27.28 66.14,22.33 R18.2
N$7
  Top 0.152: R14.2 21.18,31.77 17.83,31.77 JP4.3
N$8
  Top 0.152: X4.2 95.1,71.7 87.4,71.7 81.92,66.22 78.11,66.22 U4.15
N$9
  Top 0.152: R16.2 21.18,27.96 17.83,27.96 JP5.3
N$11
  Top 0.152: R19.2 21.18,24.16 17.83,24.16 JP6.3
N$12  (via drill 0.3)
  Top 0.152: v64.77,47.47 66.22,48.92 66.22,51.13 U2.53 | v49.53,49.3 49.53,49.53 48.77,50.29 48.77,50.75 v50.67,52.65
  Bottom 0.152: v64.77,47.47 59.66,47.47 57.53,45.34 54.48,45.34 50.52,49.3 v49.53,49.3 | v50.67,52.65 50.98,52.65 57.07,58.75 57.99,58.75 59.97,60.73 59.97,69.04 59.82,69.19 U6.9
N$13
  Top 0.152: R21.2 21.18,20.34 17.83,20.34 JP7.3
N$14  (via drill 0.3)
  Top 0.152: v71.4,51.21 71.4,49.84 69.57,48.01 68.66,48.01 66.67,49.99 U2.55 | v70.41,64.62 70.41,64.77 v67.44,67.74 | v62.64,72.54 60.81,72.54 v59.59,73.76
  Bottom 0.152: v71.4,51.21 71.4,63.63 v70.41,64.62 | v62.64,72.54 v67.44,67.74 | v59.59,73.76 58.52,74.83 U6.7
N$15
  Top 0.152: R23.2 21.18,16.54 17.83,16.54 JP8.3
N$16  (via drill 0.3)
  Top 0.152: v49.84,71.55 47.4,71.55 41.76,77.19 38.94,77.19 37.95,78.18 JP24.8
  Bottom 0.152: v49.84,71.55 52.12,69.27 U6.15
N$17
  Top 0.152: R2.2 21.18,12.72 17.83,12.72 JP9.3
N$18
  Top 0.152: R7.2 21.18,8.91 17.83,8.91 JP10.3
N$19
  Top 0.152: R11.2 21.18,5.11 17.83,5.11 JP11.3
N$20
  Top 0.152: R4.2 79.17,35.59 82.53,35.59 JP20.3
N$21
  Top 0.152: R9.2 79.17,39.4 82.53,39.4 JP21.3
N$22
  Top 0.152: R13.2 79.17,43.2 82.53,43.2 JP22.3
N$23  (via drill 0.3)
  Top 0.152: v55.93,70.79 55.93,72.69 53.19,75.44 49.45,75.44 46.56,78.33 46.56,78.64 45.95,79.25 41.53,79.25 40.54,78.26 JP24.7
  Bottom 0.152: v55.93,70.79 55.93,69.27 U6.12
N$24  (via drill 0.3)
  Top 0.152: v57.76,68.2 55.17,68.2 49.84,73.53 47.7,73.53 43.05,78.18 JP24.6
  Bottom 0.152: v57.76,68.2 58.45,68.89 58.45,69.19 U6.10
N$25  (via drill 0.3)
  Top 0.152: v54.03,73.84 49.91,73.84 45.57,78.18 JP24.5
  Bottom 0.152: v54.03,73.84 56.24,73.84 56.54,74.14 56.54,74.22 57.15,74.83 U6.6
N$26
  Top 0.152: R3.2 79.17,5.11 82.53,5.11 JP12.3
N$27
  Top 0.152: R8.2 79.17,8.91 82.53,8.91 JP13.3
N$28
  Top 0.152: R12.2 79.17,12.72 82.53,12.72 JP14.3
N$29
  Top 0.152: R15.2 79.17,16.54 82.53,16.54 JP15.3
N$30
  Top 0.152: R17.2 79.17,20.34 82.53,20.34 JP16.3
N$31
  Top 0.152: R20.2 79.17,24.16 82.53,24.16 JP17.3
N$32
  Top 0.152: R22.2 79.17,27.96 82.53,27.96 JP18.3
N$33
  Top 0.152: R24.2 79.17,31.77 82.53,31.77 JP19.3
N$34  (via drill 0.3)
  Top 0.152: v52.12,76.43 49.91,76.43 48.16,78.18 JP24.4
  Bottom 0.152: v52.12,76.43 52.2,76.5 53.57,76.5 54.63,75.44 54.63,74.91 U6.4
N$35  (via drill 0.3)
  Top 0.152: v58.83,68.12 58.83,74.14 62.71,78.03 JP27.1
  Bottom 0.152: v58.83,68.12 58.83,61.95 57.45,60.58 57.15,60.58 U8.12 | R37.1 64.85,73.91 64.85,75.97 62.79,78.03 JP27.1
N$36
  pour Bottom (no thermals): 88.99,0 88.99,48.08 75.62,48.08 75.62,-0.08 88.83,-0.08
N$37  (via drill 0.3)
  Top 0.152: v74.75,65.38 74.75,65.15 70.26,60.66 v70.26,56.24 | v68.89,54.86 68.89,54.63 69.04,54.48 69.04,53.8 U2.68
  Bottom 0.152: v74.75,65.38 74.75,66.37 U9.1 | v68.89,54.86 v70.26,56.24
N$38
  Bottom 0.152: R40.1 44.35,51.28 42.52,51.28 41.76,52.05 35.2,52.05 34.82,51.66 C17.+
N$39  (via drill 0.3)
  Top 0.152: v68.89,48.54 67.13,50.29 67.13,51.13 U2.57 | v80.09,48.39 86.18,48.39 90.98,53.19 90.98,53.87 93.27,56.16 96.47,56.16 96.93,55.7 99.06,55.7 99.52,56.16 99.52,75.59 95.1,80.01 66.75,80.01 63.78,77.04 63.78,76.89 62.1,75.21 v60.66,75.21
  Bottom 0.152: v68.89,48.54 79.93,48.54 v80.09,48.39 | v60.66,75.21 60.2,75.67 56.77,75.67 56.01,74.91 U6.5
N$40  (via drill 0.3)
  Top 0.152: v71.86,63.93 71.86,63.63 68.28,60.05 68.28,53.8 U2.64
  Bottom 0.152: v71.86,63.93 72.31,63.93 73.46,65.08 73.46,66.37 U9.3
N$41  (via drill 0.3)
  Top 0.152: v72.85,65.23 72.85,64.16 69.42,60.73 69.42,53.8 U2.70
  Bottom 0.152: v72.85,65.23 72.85,66.37 U9.4
N$42  (via drill 0.3)
  Top 0.152: v72.08,65.38 72.24,65.38 72.62,65.76 73.08,65.76 73.38,65.46 73.38,64.24 69.72,60.58 69.72,54.56 69.88,54.41 69.88,53.19 69.65,52.96 68.89,52.96 68.73,53.11 68.73,53.72 U2.66
  Bottom 0.152: v72.08,65.38 72.16,65.46 72.16,66.37 U9.5
N$43  (via drill 0.3)
  Top 0.152: v71.55,64.69 71.55,64.39 67.89,60.73 67.89,53.8 U2.62
  Bottom 0.152: v71.55,64.69 71.55,66.37 U9.6
N$44  (via drill 0.3)
  Top 0.152: v66.98,54.94 66.98,54.48 67.06,54.41 67.06,53.8 U2.58
  Bottom 0.152: v66.98,54.94 66.98,62.03 70.26,65.3 70.26,66.37 U9.8
N$45  (via drill 0.3)
  Top 0.152: v64.77,54.94 64.31,54.48 64.31,53.8 U2.44
  Bottom 0.152: v64.77,54.94 64.77,60.27 69.57,65.08 69.57,66.37 U9.9
N$46
  Bottom 0.152: SJ1.2 51.21,60.66 51.44,60.66 52.2,59.89 52.2,57.68 44.81,50.29 36.8,50.29 35.13,48.62 31.77,48.62 31.39,49 26.44,49 26.29,48.84 C26.+
N$47
  Bottom 0.152: R26.1 16.15,54.33 16.46,54.03 16.46,51.89 R27.1 16.54,51.82 17.45,51.82 19.43,49.84 19.43,48.69 19.58,48.54 23.93,48.54 24.16,48.77 C26.-
N$48
  Bottom 0.152: R28.1 20.19,49.38 20.19,50.06 21.26,51.13 21.26,51.82 U7.3
N$49
  Top 0.152: X4.3 95.1,71.09 87.25,71.09 81.69,65.53 78.11,65.53 U4.16
N$50
  Bottom 0.152: R29.2 25.68,53.49 23.16,53.49 22.63,52.96 20.95,52.96 20.65,52.65 20.65,51.89 U7.4
N$52
  Bottom 0.152: R28.2 18.44,49.38 13.26,49.38 11.89,50.75 C28.2
N$53  (via drill 0.3)
  Top 0.152: v24.99,56.24 v24.99,57.68
  Bottom 0.152: v24.99,57.68 24.61,58.06 24,58.06 C29.1 | v24.99,56.24 24.99,56.01 25.68,55.32 R29.1
N$54
  Bottom 0.152: R27.2 14.78,51.89 14.25,52.43 11.89,52.43 C28.1 11.81,52.5 11.66,52.65 C27.2
N$55  (via drill 0.3)
  Top 0.152: v20.57,57.68 20.57,58.52 20.19,58.9 20.19,59.97 v20.65,60.43
  Bottom 0.152: v20.57,57.68 20.57,56.08 U7.5 | v20.65,60.43 20.65,62.48 JP28.1
N$56  (via drill 0.3)
  Top 0.152: v20.73,59.13 v23.24,56.62
  Bottom 0.152: v23.24,56.62 23.16,56.62 22.63,56.08 U7.8 | v20.73,59.13 20.73,59.59 18.44,61.87 18.44,62.71 JP28.2
N$59
  Bottom 0.152: R41.1 7.32,10.97 7.32,8.99 9.37,6.93 X3.3
N$60
  Bottom 0.152: R42.1 6.33,5.41 9.37,2.36 X3.2
N$61
  Bottom 0.152: R42.2 4.57,5.49 3.58,6.48 3.58,11.12 R43.2 3.5,11.2 3.5,12.57 0.84,15.24 0.84,23.32 1.6,24.08 C36.1 1.68,24.16 1.68,29.87 2.52,30.71 C30.-
N$63
  Bottom 0.152: R41.2 8.99,11.05 8.99,15.85 9.91,16.76 9.91,24.92 9.14,25.68 R44.2 9.07,25.76 6.97,27.85 | 6.97,27.85 6.93,27.89 6.1,27.89 C31.1 | 6.97,27.85 8.08,28.96 8.08,31.77 C25.-
N$64  (via drill 0.3)
  Top 0.152: v59.51,71.32 68.96,71.32 71.09,69.19 78.41,69.19 78.79,69.57 R31.1
  Bottom 0.152: v59.51,71.32 55.7,71.32 55.4,71.02 55.4,68.5 57.07,66.83 57.07,65.76 U8.20
N$65
  Top 0.152: LED1.A 84.66,72.16 83.36,72.16 80.85,69.65 80.54,69.65 R31.2
N$66  (via drill 0.3)
  Top 0.152: v62.18,73.23 67.13,78.18 JP30.1
  Bottom 0.152: v62.18,73.23 59.74,70.79 57.53,70.79 56.62,69.88 56.62,68.58 57.84,67.36 57.84,64.85 57.45,64.47 57.15,64.47 U8.18
N$67  (via drill 0.3)
  Top 0.152: v42.52,64.69 39.85,64.69 35.66,68.89 Q2.2
  Bottom 0.152: C33.1 40.16,68.73 35.81,68.73 35.66,68.89 Q2.2 | v42.52,64.69 41.3,64.69 U11.26
N$68
  Top 0.152: U10.5 53.72,47.09 53.34,47.47 53.26,47.47 53.03,47.7 53.03,49.84 52.05,50.83 R34.2
N$69  (via drill 0.3)
  Top 0.152: v42.52,63.93 35.81,63.93 35.66,64.08 Q2.1
  Bottom 0.152: C32.1 36.96,59.44 36.42,59.44 35.66,60.2 35.66,64.08 Q2.1 | v42.52,63.93 42.44,64.01 41.3,64.01 U11.25
N$70
  Bottom 0.152: C34.2 33.68,58.67 35.43,58.67 37.57,56.54 C35.+ 37.57,56.62 39.09,58.14 41.22,58.14 U11.16
N$72  (via drill 0.3)
  Top 0.152: v41,55.17 41,57.68 v40.01,58.67
  Bottom 0.152: v41,55.17 41,53.03 R35.2 | v40.01,58.67 41.15,58.67 41.22,58.75 U11.17
N$73  (via drill 0.3)
  Top 0.152: v40.01,59.44 v44.35,55.09
  Bottom 0.152: v44.35,55.09 44.35,53.03 R40.2 | v40.01,59.44 41.22,59.44 U11.18
N$74
  Top 0.152: C17.- 34.75,49.53 32,49.53 30.1,47.62 JP32.2
  Bottom 0.152: R35.1 41,51.28 36.5,51.28 34.82,49.61 C17.- | R39.2 42.44,47.09 38.56,47.09 C24.1 38.48,47.17 38.02,47.17 37.64,47.55 30.1,47.55 JP32.2
RLINEIN  (via drill 0.3)
  Top 0.152: v39.93,60.2 38.86,61.27 30.79,61.27 17.53,48.01 10.36,48.01 3.81,41.45 1.6,41.45 0.99,40.84 0.99,39.93 7.01,33.91 8.08,33.91 C25.+
  Bottom 0.152: v39.93,60.2 41.22,60.2 U11.19
SD_CD  (via drill 0.3)
  Top 0.152: v67.51,66.83 67.51,53.8 U2.60 | v70.87,70.18 70.87,71.4 v74.98,75.51
  Bottom 0.152: v70.87,70.18 v67.51,66.83 | v74.98,75.51 80.31,75.51 83.21,78.41 83.74,78.41 JP25.CC1
SD_CLK  (via drill 0.3)
  Top 0.152: v80.47,74.22 80.09,74.22 v79.32,74.98
  Bottom 0.152: U9.12 69.65,72.24 70.26,72.24 U9.13 70.26,72.31 70.26,72.54 72.69,74.98 v79.32,74.98 | v80.47,74.22 83.74,74.22 JP25.5
SD_CMD  (via drill 0.3)
  Top 0.152: v80.09,72.69 v78.33,74.45
  Bottom 0.152: v78.33,74.45 73.46,74.45 71.63,72.62 71.63,72.24 U9.15 | v80.09,72.69 82.91,72.69 83.59,72.01 83.74,72.01 JP25.3
SD_DAT0  (via drill 0.3)
  Top 0.152: v72.77,71.25 74.37,71.25 78.64,75.51 v82.75,75.51
  Bottom 0.152: v72.77,71.25 72.24,71.78 72.24,72.16 U9.16 | v82.75,75.51 83.59,76.35 83.74,76.35 JP25.7
SD_DAT1
  Bottom 0.152: U9.17 72.92,72.24 72.92,72.62 74.22,73.91 79.17,73.91 82.68,77.42 83.74,77.42 JP25.8
SD_DAT2  (via drill 0.3)
  Top 0.152: v81.99,71.55 v79.78,73.76
  Bottom 0.152: v79.78,73.76 79.63,73.61 74.52,73.61 73.53,72.62 73.53,72.24 U9.18 | v81.99,71.55 81.99,71.4 83.59,69.8 83.74,69.8 JP25.1
SD_DAT3
  Bottom 0.152: U9.20 74.83,72.16 82.3,72.16 83.52,70.94 83.74,70.94 JP25.2
SHUTDOWN  (via drill 0.3)
  Top 0.152: v45.8,50.52 41.83,50.52 37.72,46.41 27.36,46.41 25.15,48.62 25.15,49.3 v23.24,51.21
  Bottom 0.152: v45.8,50.52 56.46,61.19 57.07,61.19 U8.13 | v23.24,51.21 22.63,51.82 U7.1
UART_RXD
  Top 0.152: U2.22 59.89,53.72 59.89,53.11 60.35,52.65 71.25,52.65 75.82,57.23 84.89,57.23 85.34,57.68 U4.1
UART_TXD
  Top 0.152: U2.27 61.11,51.21 61.11,51.82 61.65,52.35 71.4,52.35 75.97,56.92 85.88,56.92 86.33,57.38 86.33,59.97 86.03,60.27 85.42,60.27 U4.5
USB_DN  (via drill 0.3)
  Top 0.152: v82.3,67.36 81.38,68.28 64.85,68.28 58.9,62.33 58.9,60.73 59.05,60.58 59.05,53.8 U2.18 | v91.75,64.47 94.64,61.57 95.25,61.57 X2.2
  Bottom 0.152: v82.3,67.36 82.6,67.36 85.5,64.47 v91.75,64.47
USB_DP  (via drill 0.3)
  Top 0.152: v81.84,68.58 64.69,68.58 58.6,62.48 58.6,60.58 58.67,60.5 58.67,53.8 U2.16 | v90.45,65 94.56,60.88 95.25,60.88 X2.3
  Bottom 0.152: v81.84,68.58 85.42,65 v90.45,65
USB_FAULT
  Top 0.152: 54.22,51.7 51.97,53.95 R32.1 | 54.22,51.7 54.25,51.66 54.25,49.07 53.8,48.62 53.8,48.08 U10.4 | 54.22,51.7 54.79,52.27 58.98,52.27 59.44,51.82 59.44,51.21 U2.19
USB_ID  (via drill 0.3)
  Top 0.152: v57.68,49.07 56.31,50.44 56.31,51.13 U2.3 | v71.63,48.01 76.66,53.03 76.66,53.42 79.86,56.62 91.14,56.62 94.72,60.2 95.25,60.2 X2.4
  Bottom 0.152: v57.68,49.07 62.79,49.07 63.86,48.01 v71.63,48.01
USB_PSW
  Top 0.152: 57.49,48.12 59.82,50.44 59.82,51.13 U2.21 | 57.49,48.12 57.45,48.08 56.08,48.08 U10.3 | R33.1 50.52,46.79 52.05,46.79 53.26,45.57 57.15,45.57 57.53,45.95 57.53,48.08 57.49,48.12
USB_VBUS  (via drill 0.3)
  Top 0.152: 93.31,63.89 95.02,62.18 95.25,62.18 X2.1 | 93.31,63.89 91.97,65.23 91.97,65.68 C16.1 | v55.24,51.05 55.24,47.4 54.03,46.18 53.8,46.18 U10.6 | v59.28,52.73 59.28,52.96 59.44,53.11 59.44,53.72 U2.20 | v93.19,63.86 93.27,63.86 93.31,63.89
  Bottom 0.152: v55.24,51.05 57.61,51.05 v59.28,52.73 59.28,52.65 60.66,51.28 70.1,51.28 70.94,50.44 78.03,50.44 78.72,51.13 78.72,52.96 79.78,54.03 83.36,54.03 v93.19,63.86
V+
  Top 0.254: JP12.2 85.11,5.11 85.11,6.48 85.27,6.63 85.27,7.32 85.11,7.47 85.11,8.84 JP13.2 85.11,8.99 85.11,10.21 85.27,10.36 85.27,11.12 85.11,11.28 85.11,12.65 JP14.2 85.11,12.8 85.11,14.02 85.27,14.17 85.27,14.94 85.11,15.09 85.11,16.46 JP15.2 85.11,16.61 85.11,17.83 85.27,17.98 85.27,18.75 85.11,18.9 85.11,20.27 JP16.2 85.11,20.42 85.11,21.64 85.27,21.79 85.27,22.55 85.11,22.71 85.11,24.08 JP17.2 85.11,24.23 85.11,25.45 85.27,25.6 85.27,26.36 85.11,26.52 85.11,27.89 JP18.2 85.11,28.04 85.11,29.26 85.27,29.41 85.27,30.18 85.11,30.33 85.11,31.7 JP19.2 85.11,31.85 85.11,33.07 85.27,33.22 85.27,33.98 85.11,34.14 85.11,35.51 JP20.2 85.11,35.66 85.11,36.88 85.27,37.03 85.27,37.8 85.11,37.95 85.11,39.32 JP21.2 85.11,39.47 85.11,40.69 85.27,40.84 85.27,41.6 85.11,41.76 85.11,43.13 JP22.2 | JP11.2 15.24,6.1 14.4,6.93 14.4,7.01 15.24,7.85 JP10.2 15.16,8.99 15.16,9.98 14.4,10.74 14.4,10.82 15.24,11.66 JP9.2 15.16,12.8 15.16,13.79 14.4,14.55 14.4,14.63 15.24,15.47 JP8.2 15.16,16.61 15.16,17.6 14.4,18.36 14.4,18.44 15.24,19.28 JP7.2 15.16,20.42 15.16,21.41 14.4,22.17 14.4,22.25 15.24,23.09 JP6.2 15.16,24.23 15.16,25.22 14.4,25.98 14.4,26.06 15.24,26.9 JP5.2 15.16,28.04 15.16,29.03 14.4,29.79 14.4,29.87 15.24,30.71 JP4.2 15.16,31.85 15.16,32.84 14.4,33.6 14.4,33.68 15.24,34.52 JP3.2 15.16,35.66 15.16,36.65 14.4,37.41 14.4,37.49 15.24,38.33 JP2.2 15.16,39.47 15.16,40.46 14.4,41.22 14.4,41.3 | JP1.2 15.24,42.14 14.4,41.3 | S1.1 2.97,40.39 11.43,40.39 12.27,41.22 14.33,41.22 14.4,41.3
  Bottom 0.254: JP1.2 15.24,43.66 19.36,47.78 26.59,47.78 27.43,48.62 31.24,48.62 31.62,48.23 35.28,48.23 36.96,49.91 79.4,49.91 85.04,44.27 85.04,43.2 JP22.2
VBUS  (via drill 0.3)
  Top 0.152: v93.95,72.24 94.11,72.39 95.1,72.39 X4.1 | v81.61,60.88 79.63,62.87 78.11,62.87 U4.20
  Bottom 0.152: v93.95,72.24 93.95,65.91 90.6,62.56 C13.+ 90.53,62.48 88.7,60.66 82.6,60.66 C12.1 82.53,60.66 82.3,60.88 v81.61,60.88
VCC
  Top 0.254: 9.53,65.23 9.53,65.99 12.27,68.73 12.27,69.57 C5.+ 12.42,69.65 12.57,69.65 13.64,70.71 18.82,70.71 IC1.IN 18.97,70.79 25.3,77.11 26.44,77.11 IC2.IN | 9.53,65.23 9.53,64.62 TP4.TP 9.45,64.47 9.45,49.45 2.97,42.98 S1.2 | 9.53,65.23 3.43,65.23 2.67,65.99 2.67,67.06 4.88,69.27 4.88,77.11 D1.C
  Bottom 0.254: C6.1 5.03,73.53 5.03,77.04 4.95,77.11 D1.C

## Text on the board
tNames: SERIAL | DGND | AGND | +5V | +7.2V | AVCC | DVCC | Intel Edison | OTG | SCL | y-modify.org/yamax | SDA | 方向厳守 | <> Y-modify/axion | axion 1.0
bNames: release/1.0.0 d0755c0 | v1.0.0 2017/10/15